# EAGLE schematic Mikro_SD_Karte (EAGLE 9.0.1)
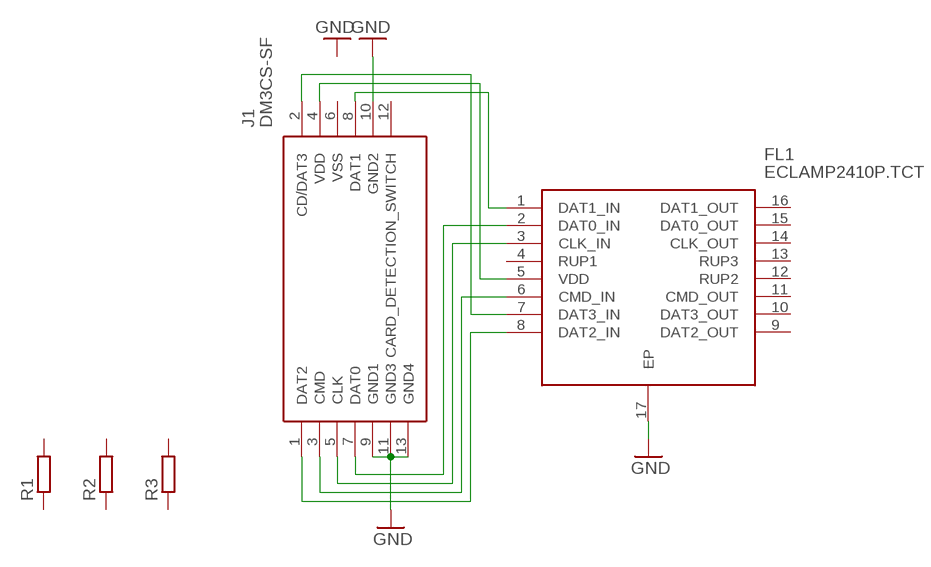
[diagram p0: schematic, sheet 1]

## Parts
FL1  ECLAMP2410P.TCT  [SON50P160X400X65-17N]
J1  DM3CS-SF  [DM3CS-SF]
R1  R-EU_R0603  [R0603]
R2  R-EU_R0603  [R0603]
R3  R-EU_R0603  [R0603]

## Nets
GND: FL1.17(EP) J1.9(GND1) J1.10(GND2) J1.11(GND3) J1.13(GND4)
N$1: FL1.1(DAT1_IN) J1.8(DAT1)
N$2: FL1.8(DAT2_IN) J1.1(DAT2)
N$3: FL1.5(VDD) J1.4(VDD)
N$4: FL1.7(DAT3_IN) J1.2(CD/DAT3)
N$5: FL1.2(DAT0_IN) J1.7(DAT0)
N$6: FL1.3(CLK_IN) J1.5(CLK)
N$7: FL1.6(CMD_IN) J1.3(CMD)
Unconnected: FL1.4(RUP1) FL1.9(DAT2_OUT) FL1.10(DAT3_OUT) FL1.11(CMD_OUT) FL1.12(RUP2) FL1.13(RUP3) FL1.14(CLK_OUT) FL1.15(DAT0_OUT) FL1.16(DAT1_OUT) J1.6(VSS) J1.12(CARD_DETECTION_SWITCH) R1.1 R1.2 R2.1 R2.2 R3.1 R3.2

## Library data of the parts
FL1 = SamacSys_Parts:ECLAMP2410P.TCT: EClamp ESD-EMI Protect T-Flash/MicroSD Semtech ECLAMP2410P.TCT, Hex Bi-Directional EMI Filter & ESD Protector, 16-Pin SLP EP Source: Datasheet <http://www.semtech.com/images/datasheet/eclamp2410p.pdf>; ARROW_PART_NUMBER: ECLAMP2410P.TCT; ARROW_PRICE/STOCK: https://www.arrow.com/en/products/eclamp2410p.tct/semtech; DESCRIPTION: EClamp ESD-EMI Protect T-Flash/MicroSD Semtech ECLAMP2410P.TCT, Hex Bi-Directional EMI Filter & ESD Protector, 16-Pin SLP EP; HEIGHT: 0.65mm; MANUFACTURER_NAME: SEMTECH; MANUFACTURER_PART_NUMBER: ECLAMP2410P.TCT; RS_PART_NUMBER: 6910638; RS_PRICE/STOCK: http://uk.rs-online.com/web/p/products/6910638
J1 = SamacSys_Parts:DM3CS-SF: MicroSD card connector, push-pull type MicroSD card connector, push-pull type Source: Datasheet <http://docs-europe.electrocomponents.com/webdocs/118f/0900766b8118f8bb.pdf>; ARROW_PART_NUMBER: DM3CS-SF; ARROW_PRICE/STOCK: https://www.arrow.com/en/products/dm3cs-sf/hirose-electric; DESCRIPTION: MicroSD card connector, push-pull type MicroSD card connector, push-pull type; HEIGHT: mm; MANUFACTURER_NAME: Hirose; MANUFACTURER_PART_NUMBER: DM3CS-SF; RS_PART_NUMBER: 1664833; RS_PRICE/STOCK: http://uk.rs-online.com/web/p/products/1664833
R1-R3 = rcl:R-EU_: RESISTOR, European symbol